# EAGLE design Handclap-TR808 (EAGLE 7.2.0)
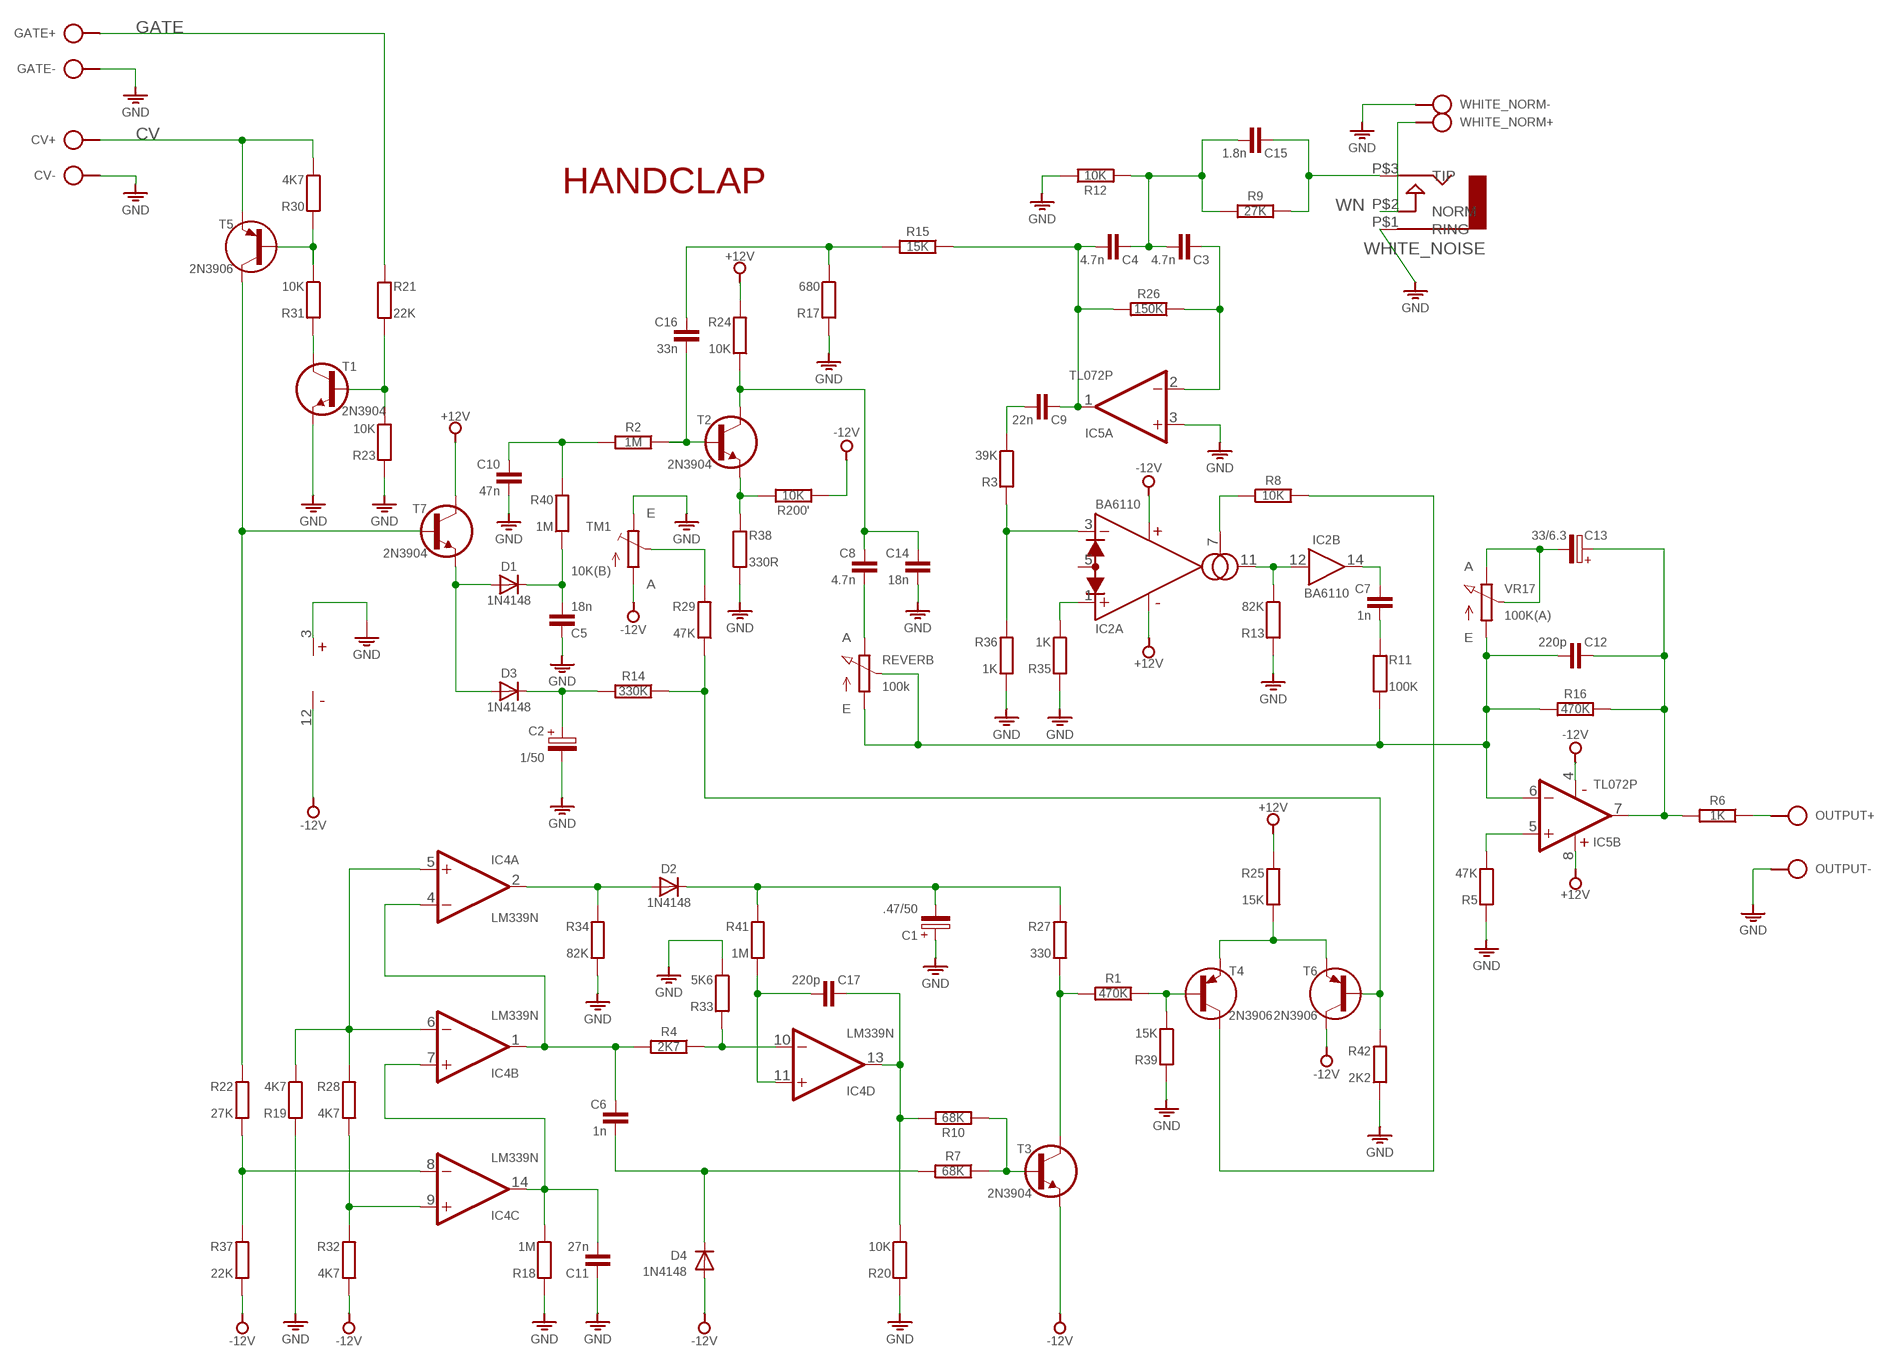
[diagram p0: schematic, sheet 1]

## Parts
C1  .47/50  CPOLE2,5-3/V  [E2,5-3/V]
C2  1/50  CPOLE2,5-4/V  [E2.5-4/V]
C3  4.7n  C-H050-020X044  [C050-020X044]
C4  4.7n  C-H050-020X044  [C050-020X044]
C5  18n  C050-020X044/V  [C050-020X044/V]
C6  1n  C050-020X044/V  [C050-020X044/V]
C7  1n  C050-020X044/V  [C050-020X044/V]
C8  4.7n  C050-020X044/V  [C050-020X044/V]
C9  22n  C-H050-020X044  [C050-020X044]
C10  47n  C050-020X044/V  [C050-020X044/V]
C11  27n  C050-020X044/V  [C050-020X044/V]
C12  220p  C-H050-020X044  [C050-020X044]
C13  33/6.3  CPOL-HE2,5-3  [E2,5-3]
C14  18n  C050-020X044/V  [C050-020X044/V]
C15  1.8n  C-H050-020X044  [C050-020X044]
C16  33n  C050-020X044/V  [C050-020X044/V]
C17  220p  C-H050-020X044  [C050-020X044]
CV  SPAD+--+  [SPAD-+]
D1  1N4148  DIODE-HDO34-10  [DO34-10]
D2  1N4148  DIODE-HDO34-2,5-A/V  [DO34-2,5-A/V]
D3  1N4148  DIODE-HDO34-10  [DO34-10]
D4  1N4148  DIODE34-7V  [DO34-7V]
GATE  SPAD+--+  [SPAD-+]
IC2  BA6110  BA6110-DIL16  [DIL16]
IC4  LM339N  [DIL14]
IC5  TL072P  [DIL08]
OUTPUT  SPAD+--+  [SPAD-+]
PWR1  -12V_GND_+12V-VCC-VEE  [SPAD-PWR-+GND-]
R1  470K  R-H0204/10  [0204/10]
R2  1M  R-H0204/10  [0204/10]
R3  39K  R0204/10-V  [0204/10-V]
R4  2K7  R-H0204/10  [0204/10]
R5  47K  R0204/10-V  [0204/10-V]
R6  1K  R-H0204/10  [0204/10]
R7  68K  R-H0204/10  [0204/10]
R8  10K  R-H0204/10  [0204/10]
R9  27K  R-H0204/10  [0204/10]
R10  68K  R-H0204/10  [0204/10]
R11  100K  R0204/10-V  [0204/10-V]
R12  10K  R-H0204/10  [0204/10]
R13  82K  R0204/10-V  [0204/10-V]
R14  330K  R-H0204/10  [0204/10]
R15  15K  R-H0204/10  [0204/10]
R16  470K  R-H0204/10  [0204/10]
R17  680  R0204/10-V  [0204/10-V]
R18  1M  R0204/10-V  [0204/10-V]
R19  4K7  R0204/10-V  [0204/10-V]
R20  10K  R0204/10-V  [0204/10-V]
R21  22K  R0204/10-V  [0204/10-V]
R22  27K  R0204/10-V  [0204/10-V]
R23  10K  R0204/10-V  [0204/10-V]
R24  10K  R0204/10-V  [0204/10-V]
R25  15K  R0204/10-V  [0204/10-V]
R26  150K  R-H0204/10  [0204/10]
R27  330  R0204/10-V  [0204/10-V]
R28  4K7  R0204/10-V  [0204/10-V]
R29  47K  R0204/10-V  [0204/10-V]
R30  4K7  R0204/10-V  [0204/10-V]
R31  10K  R0204/10-V  [0204/10-V]
R32  4K7  R0204/10-V  [0204/10-V]
R33  5K6  R0204/10-V  [0204/10-V]
R34  82K  R0204/10-V  [0204/10-V]
R35  1K  R0204/10-V  [0204/10-V]
R36  1K  R0204/10-V  [0204/10-V]
R37  22K  R0204/10-V  [0204/10-V]
R38  330R  R0204/10-V  [0204/10-V]
R39  15K  R0204/10-V  [0204/10-V]
R40  1M  R0204/10-V  [0204/10-V]
R41  1M  R0204/10-V  [0204/10-V]
R42  2K2  R0204/10-V  [0204/10-V]
R200'  10K  R-H0204/10  [0204/10]
REVERB  100k  POT-3P  [CONN-3P]
T1  2N3904  [TO92]
T2  2N3904  [TO92]
T3  2N3904  [TO92]
T4  2N3906  [TO92]
T5  2N3906  [TO92]
T6  2N3906  [TO92]
T7  2N3904  [TO92]
TM1  10K(B)  TRIMR-TRIM  [R-TRIM]
VR17  100K(A)  POT-3P  [CONN-3P]
WHITE_NOISE  AUDIO-JACK  [ERTHENVAR-JACK-90DEG]
WHITE_NORM  SPAD+-+-  [SPAD+-]

## Nets
+12V [Power]: IC2.9(1:V-) IC5.8(P:V+) PWR1.VCC R24.1 R25.1 T7.3(C)
-12V: D4.A IC2.15(1:V+) IC4.12(5:V-) IC5.4(P:V-) PWR1.VEE R32.2 R37.2 R200'.2 T3.1(E) T6.3(C) TM1.1(A)
A_OUT: D2.A IC4.2(A:OUT) R34.1
B_OUT: C6.1 IC4.1(B:OUT) IC4.4(A:-IN) R4.2
C_OUT: C11.2 IC4.7(B:+IN) IC4.14(C:OUT) R18.2
CV: CV.2 R30.2 T5.1(E)
D_OUT: C17.1 IC4.13(D:OUT) R10.1 R20.2
GATE: GATE.2 R21.1
GND [GND]: C1.+ C2.- C5.1 C10.2 C11.1 C14.2 CV.1 GATE.1 IC4.3(5:V+) IC5.3(A:+IN) OUTPUT.1 PWR1.GND R5.1 R12.1 R13.1 R17.1 R18.1 R19.1 R20.1 R23.1 R33.2 R34.2 R35.1 R36.2 R38.2 R39.1 R42.2 T1.1(E) TM1.3(E) WHITE_NOISE.P$1(RING) WHITE_NORM.1
N$1: OUTPUT.2 R6.1
N$2: WHITE_NOISE.P$2(NORM) WHITE_NORM.2
N$3: R31.1 T1.3(C)
N$4: R21.2 R23.2 T1.2(B)
N$10: C4.2 C9.1 IC5.1(A:OUT) R15.1 R26.2
N$37: R30.1 R31.2 T5.2(B)
N$40: C16.2 R2.1 T2.2(B)
N$41: C5.2 D1.C R40.2
N$42: R38.1 R200'.1 T2.1(E)
N$43: R22.1 T5.3(C) T7.2(B)
N$44: D1.A D3.A T7.1(E)
N$45: C10.1 R2.2 R40.1
N$46: C8.1 C14.1 R24.2 T2.3(C)
N$47: C2.+ D3.C R14.2
N$48: R14.1 R29.2 R42.1 T6.2(B)
N$49: R29.1 TM1.2(S)
N$50: C16.1 R15.2 R17.2
N$52: C3.2 C4.1 C15.2 R9.2 R12.2
N$54: C3.1 IC5.2(A:-IN) R26.1
N$55: C9.2 R3.2
N$56: IC2.3(A:-IN) R3.1 R36.1
N$57: C8.2 REVERB.3(E)
N$59: IC2.1(A:+IN) R35.2
N$60: IC2.7(A:AMP/BIAS) R8.1
N$61: IC2.11(A:OUT) IC2.12(B:B_IN) R13.2
N$62: C7.2 R11.1
N$63 [special]: C7.1 IC2.14(B:B_OUT)
N$64: IC4.5(A:+IN) IC4.6(B:-IN) R19.2 R28.1
N$65: C1.- D2.C R27.1 R41.1
N$66: R1.1 R39.2 T4.2(B)
N$67: R25.2 T4.1(E) T6.1(E)
N$69: R8.2 T4.3(C)
N$70: R1.2 R27.2 T3.3(C)
N$71: IC4.9(C:+IN) R28.2 R32.1
N$72: C17.2 IC4.11(D:+IN) R41.2
N$73: IC4.10(D:-IN) R4.1 R33.1
N$74: IC4.8(C:-IN) R22.2 R37.1
N$75: R7.1 R10.2 T3.2(B)
N$76: C6.2 D4.C R7.2
N$91: IC5.5(B:+IN) R5.2
N$92 [special]: C12.2 IC5.6(B:-IN) R11.2 R16.2 REVERB.1(A) REVERB.2(S) VR17.1(A)
N$95: C13.- VR17.2(S) VR17.3(E)
N$97: C12.1 C13.+ IC5.7(B:OUT) R6.2 R16.1
WN: C15.1 R9.1 WHITE_NOISE.P$3(TIP)
Unconnected: IC2.5(A:DIODE/BIAS)

## Notes on the sheet
- HANDCLAP

## Library data of the parts
C1 C2 = c:CPOL: POLARIZED CAPACITOR, European symbol
C3 C4 C9 C12 C15 C17 = c:C-H
C5-C8 C10 C11 C14 C16 = c:C: CAPACITOR, European symbol
C13 = c:CPOL-H
CV GATE OUTPUT WHITE_NORM = pad:SPAD+-
D1-D3 = d:DIODE-H
D4 = d:DIODE
IC2 = ic:BA6110
IC4 = ic:LM339
IC5 = ic:TL072: Low-Noise JFET-Input Operational Amplifiers http://www.ti.com/lit/ds/symlink/tl072.pdf
PWR1 = pad:-12V_GND_+12V
R1 R2 R4 R6-R10 R12 R14-R16 R26 R200' = r:R-H
R3 R5 R11 R13 R17-R25 R27-R42 = r:R: RESISTOR, European symbol
REVERB VR17 = r:POT
T1-T3 T7 = t:2N3904
T4-T6 = t:2N3906
TM1 = r:TRIM: POTENTIOMETER
WHITE_NOISE = erthenvar:AUDIO-JACK: Switching Mono 3.5mm Audio Jack from Erthenvar.

## Net classes
0 default: width 0.61 mm
1 GND: width 0.61 mm
2 Power: width 0.61 mm
3 special: width 0.61 mm
4 15v: width 0.61 mm

## Board
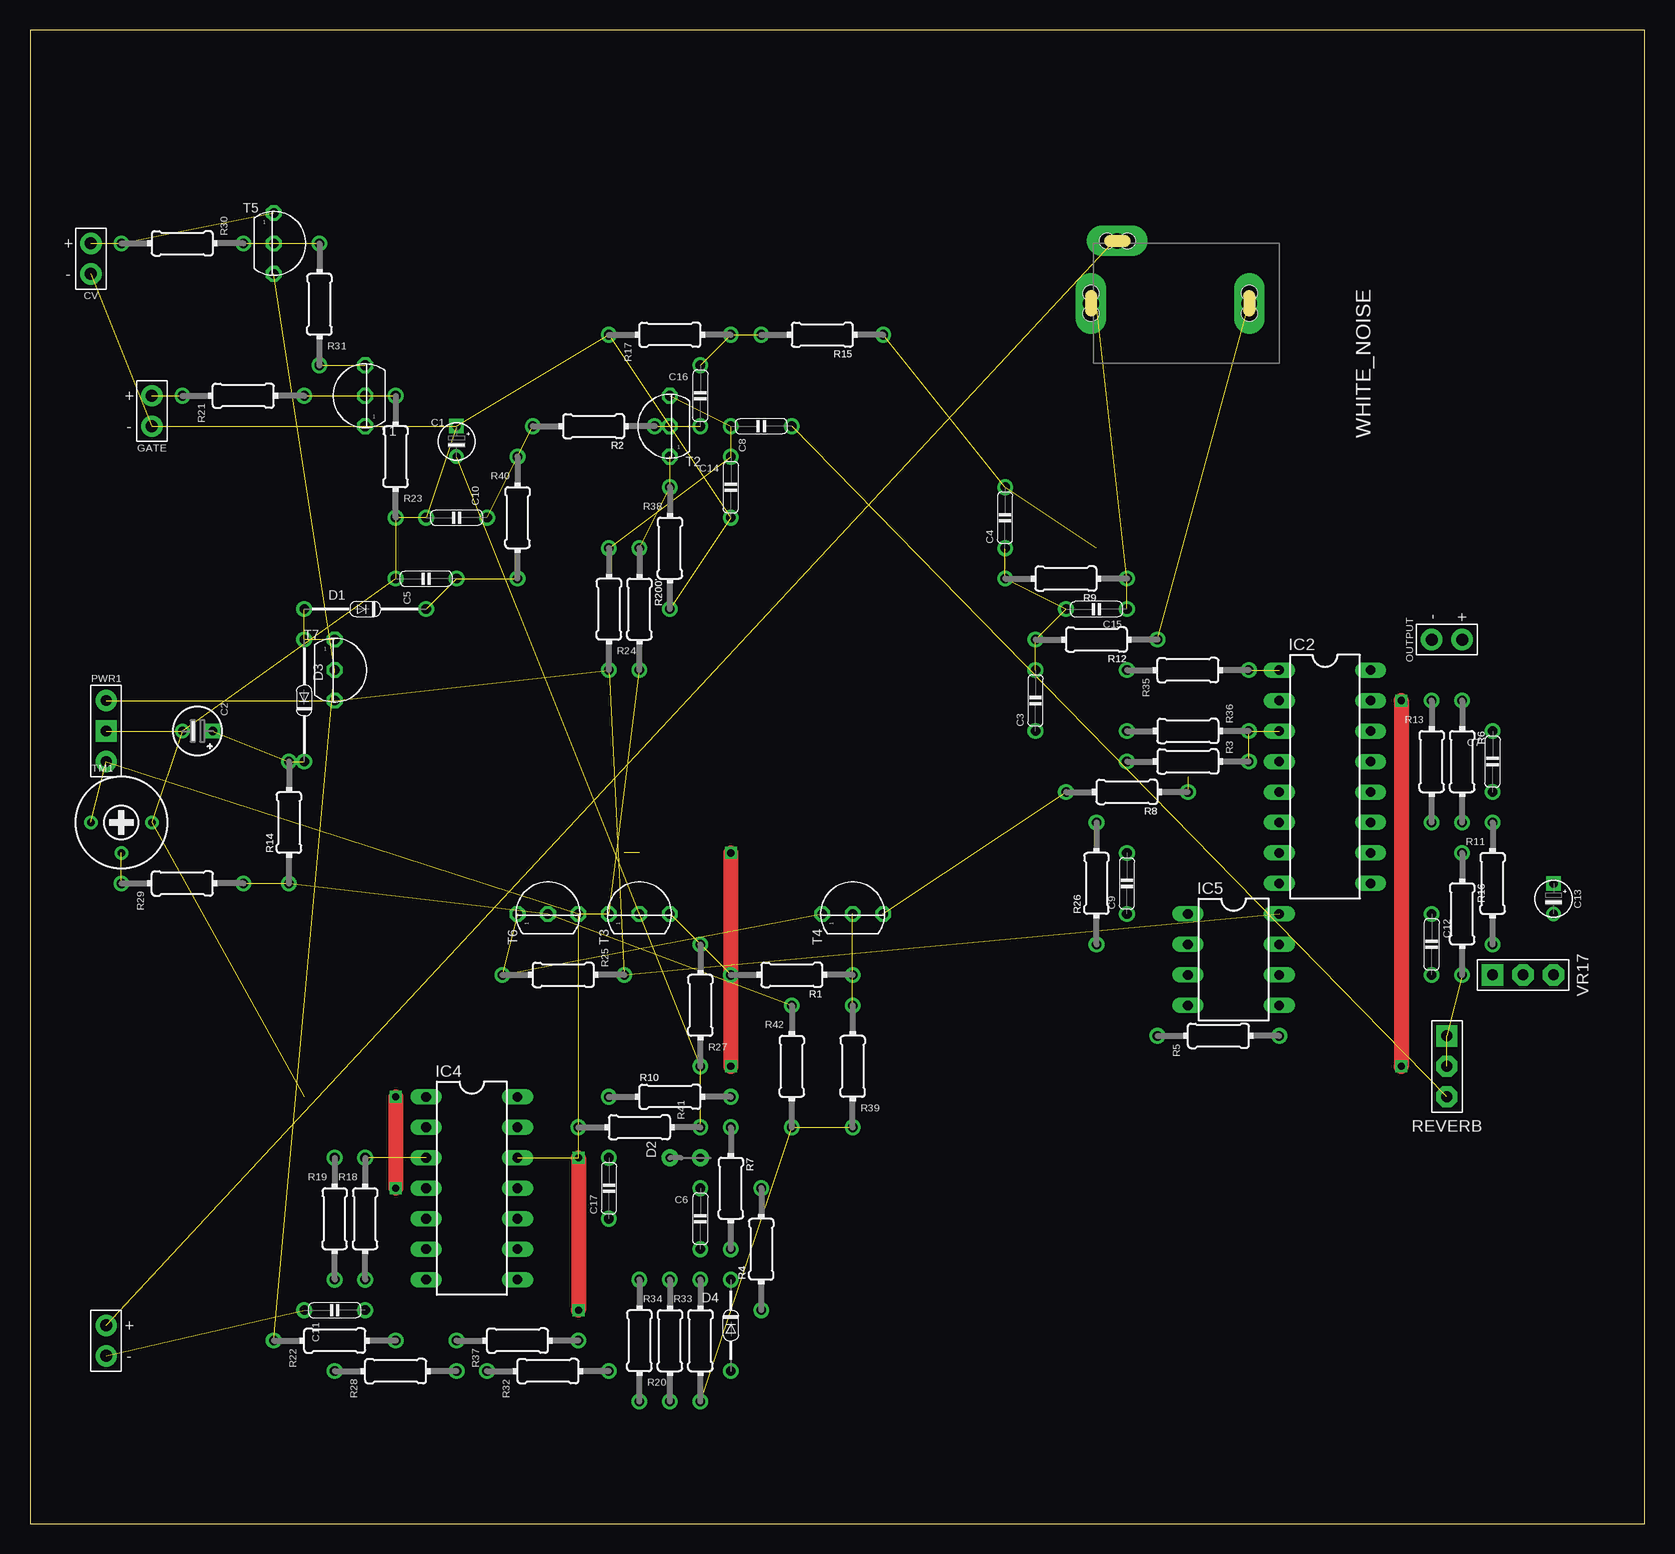
[diagram p1: board, top side]
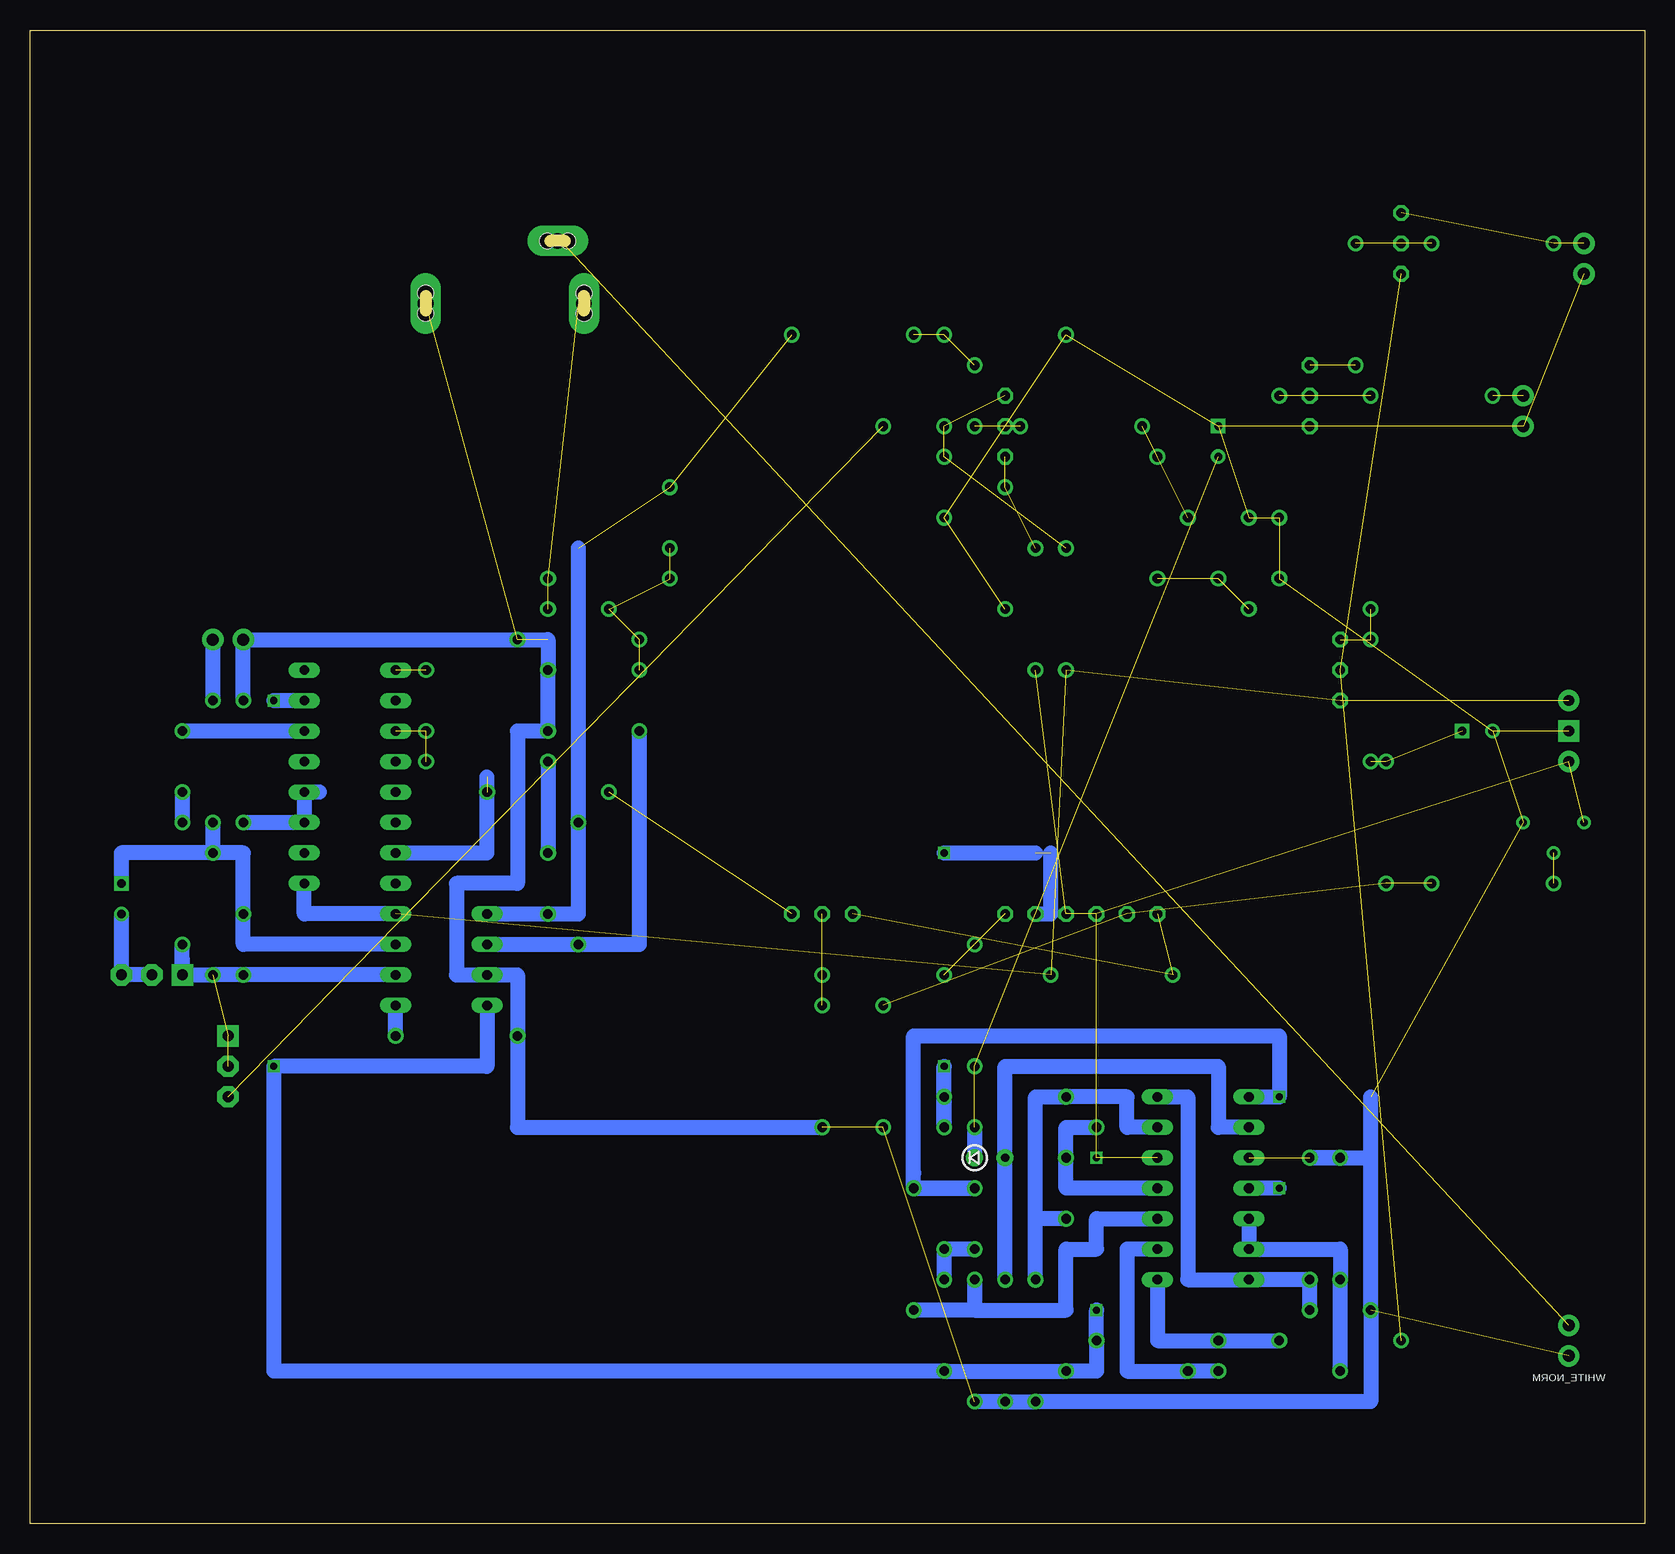
[diagram p2: board, bottom side, seen from below]

Size 134.62 x 124.46 mm. Coordinates in mm from the lower left corner, seen from the top.
Outline: 0,0 134.62,0 134.62,124.46 0,124.46 0,0
Copper layers (1*16): Top 0.035mm / dielectric 1.5mm / Bottom 0.035mm
Design rules "default": minimum track width 10mil, minimum drill 24mil, track to track 8mil, track to pad 8mil, pad to pad 8mil, via to via 8mil, smd to smd 8mil, copper to edge 40mil, drill to drill 8mil, minimum pad ring 10mil, minimum via ring 8mil, stop-mask expansion 4mil, vias tented up to drill 0mil, thermal gap 10mil

### Footprints (pad centres in the part's own frame; a part is rotated, then mirrored left to right if it is on the bottom)
E2,5-3/V = drill 0.7 square: + 0,1.27 | drill 0.7: - 0,-1.27
E2.5-4/V = drill 0.7 square: + 0,1.27 | drill 0.7: - 0,-1.27
C050-020X044 = drill 0.8: 1 -2.54,0; 2 2.54,0
C050-020X044/V = drill 0.8: 1 0,2.54; 2 0,-2.54
E2,5-3 = drill 0.7 square: + -1.27,0 | drill 0.7: - 1.27,0
SPAD-+ = drill 1 pad 1.778: 1 0,-1.27; 2 0,1.27
DO34-10 = drill 0.8: A 5.08,0; C -5.08,0
DO34-2,5-A/V = drill 0.7 pad 1.422: A 0,1.27; C 0,-1.27
DO34-7V = drill 0.8: A 0,-3.81; C 0,3.81
DIL16 = drill 0.8 long: 1 -3.81,8.89; 2 -3.81,6.35; 3 -3.81,3.81; 4 -3.81,1.27; 5 -3.81,-1.27; 6 -3.81,-3.81; 7 -3.81,-6.35; 8 -3.81,-8.89; 9 3.81,-8.89; 10 3.81,-6.35; 11 3.81,-3.81; 12 3.81,-1.27; 13 3.81,1.27; 14 3.81,3.81; 15 3.81,6.35; 16 3.81,8.89
DIL14 = drill 0.8 long: 1 -3.81,7.62; 2 -3.81,5.08; 3 -3.81,2.54; 4 -3.81,0; 5 -3.81,-2.54; 6 -3.81,-5.08; 7 -3.81,-7.62; 8 3.81,-7.62; 9 3.81,-5.08; 10 3.81,-2.54; 11 3.81,0; 12 3.81,2.54; 13 3.81,5.08; 14 3.81,7.62
DIL08 = drill 0.8 pad 1.27 long: 1 -3.81,3.81; 2 -3.81,1.27; 3 -3.81,-1.27; 4 -3.81,-3.81; 5 3.81,-3.81; 6 3.81,-1.27; 7 3.81,1.27; 8 3.81,3.81
SPAD-PWR-+GND- = drill 0.9 pad 1.778 square: GND 0,0 | drill 0.9 pad 1.778: VCC 0,2.54; VEE 0,-2.54
0204/10 = drill 0.8: 1 -5.08,0; 2 5.08,0
0204/10-V = drill 0.8: 1 0,5.08; 2 0,-5.08
CONN-3P = drill 0.9 pad 1.778 square: 1 0,-2.54 | drill 0.9 pad 1.778 octagon: 2 0,0; 3 0,2.54
TO92 = drill 0.8 octagon: 1 0,2.54; 2 0,0; 3 0,-2.54
R-TRIM = drill 0.61: 1 -2.54,0; 2 0,-2.54; 3 2.54,0
ERTHENVAR-JACK-90DEG = drill 1.3 pad 2.54 long: P$1 5,-2.5; P$2 -0.2,-13.5; P$3 5,-15.7 | hole 1.3: 5.842,-2.489; 4.14,-2.489; -0.203,-12.649; -0.203,-14.351; 5.842,-15.697; 4.166,-15.697
SPAD+- = drill 1 pad 1.778: 1 0,-1.27; 2 0,1.27

### Placement (x,y rotation side)
C1  35.56,90.17 0 top
C2  13.97,66.04 270 top
C3  83.82,68.58 90 top
C4  81.28,83.82 90 top
C5  33.02,78.74 90 top
C6  55.88,25.4 0 top
C7  121.92,63.5 0 top
C8  60.96,91.44 90 top
C9  91.44,53.34 90 top
C10  35.56,83.82 270 top
C11  25.4,17.78 90 top
C12  116.84,48.26 270 top
C13  127,52.07 270 top
C14  58.42,86.36 0 top
C15  88.9,76.2 180 top
C16  55.88,93.98 0 top
C17  48.26,27.94 90 top
CV  5.08,105.41 0 top
D1  27.94,76.2 180 top
D2  54.61,30.48 90 top
D3  22.86,68.58 90 top
D4  58.42,16.51 0 top
GATE  10.16,92.71 0 top
IC2  107.95,62.23 0 top
IC4  36.83,27.94 0 top
IC5  100.33,46.99 0 top
OUTPUT  118.11,73.66 270 top
PWR1  6.35,66.04 0 top
R1  63.5,45.72 180 top
R2  46.99,91.44 180 top
R3  96.52,63.5 270 top
R4  60.96,22.86 90 top
R5  99.06,40.64 90 top
R6  119.38,63.5 270 top
R7  58.42,27.94 270 top
R8  91.44,60.96 180 top
R9  86.36,78.74 180 top
R10  53.34,35.56 0 top
R11  121.92,53.34 0 top
R12  88.9,73.66 180 top
R13  116.84,63.5 0 top
R14  21.59,58.42 90 top
R15  66.04,99.06 180 top
R16  119.38,50.8 270 top
R17  53.34,99.06 90 top
R18  27.94,25.4 0 top
R19  25.4,25.4 0 top
R20  50.8,15.24 180 top
R21  17.78,93.98 90 top
R22  25.4,15.24 90 top
R23  30.48,88.9 180 top
R24  48.26,76.2 180 top
R25  44.45,45.72 270 top
R26  88.9,53.34 90 top
R27  55.88,43.18 180 top
R28  30.48,12.7 90 top
R29  12.7,53.34 90 top
R30  12.7,106.68 270 top
R31  24.13,101.6 180 top
R32  43.18,12.7 90 top
R33  55.88,15.24 0 top
R34  53.34,15.24 0 top
R35  96.52,71.12 90 top
R36  96.52,66.04 270 top
R37  40.64,15.24 90 top
R38  53.34,81.28 0 top
R39  68.58,38.1 180 top
R40  40.64,83.82 0 top
R41  50.8,33.02 270 top
R42  63.5,38.1 0 top
R200'  50.8,76.2 270 top
REVERB  118.11,38.1 180 top
T1  27.94,93.98 180 top
T2  53.34,91.44 180 top
T3  50.8,50.8 90 top
T4  68.58,50.8 90 top
T5  20.32,106.68 0 top
T6  43.18,50.8 90 top
T7  25.4,71.12 0 top
TM1  7.62,58.42 0 top
VR17  124.46,45.72 270 top
WHITE_NOISE  104.14,106.68 270 top
WHITE_NORM  6.35,15.24 0 top

### Tracks (layer width: path | path; a pad name or v marks a point on that pad's centre or on a via)
+12V  (4 unrouted)
  Bottom 1.27: IC5.8 111.76,50.8 IC2.9
-12V  (via drill 0.6)  (6 unrouted)
  Top 1.27: v45.72,30.48 v45.72,17.78 | v114.3,68.58 v114.3,38.1
  Bottom 1.27: v45.72,17.78 R37.2 45.72,12.7 R32.2 D4.A 114.3,12.7 v114.3,38.1 96.52,38.1 IC5.4 | IC2.15 v114.3,68.58
A_OUT
  Bottom 1.27: IC4.2 35.56,33.02 35.56,38.1 53.34,38.1 D2.A R34.1
B_OUT  (via drill 0.6)
  Top 1.27: v30.48,35.56 v30.48,27.94
  Bottom 1.27: IC4.1 v30.48,35.56 30.48,40.64 60.96,40.64 60.96,29.21 R4.2 | v30.48,27.94 IC4.4 | R4.2 C6.1 R4.2
C_OUT
  Bottom 1.27: IC4.14 38.1,35.56 38.1,20.32 IC4.7 R18.2 C11.2
CV  (2 unrouted)
D_OUT
  Bottom 1.27: IC4.13 43.18,33.02 43.18,35.56 R10.1 50.8,35.56 50.8,25.4 | R20.2 50.8,25.4 | C17.1 50.8,25.4
GATE  (1 unrouted)
GND  (19 unrouted)
  Bottom 1.27: 22.86,30.48 R18.1 R19.1 | 22.86,30.48 22.86,35.56 | R33.2 R34.2 R20.1 22.86,10.16 C11.1 22.86,30.48 | R13.1 OUTPUT.1 91.44,73.66 R35.1 R36.2 93.98,66.04 93.98,53.34 99.06,53.34 99.06,45.72 IC5.3 93.98,45.72 R5.1 93.98,33.02 R39.1
N$1
  Bottom 1.27: OUTPUT.2 R6.1
N$2  (1 unrouted)
N$3  (1 unrouted)
N$4  (2 unrouted)
N$10  (2 unrouted)
  Bottom 1.27: 88.9,81.28 R26.2 88.9,50.8 C9.1 IC5.1
N$37  (2 unrouted)
N$40  (2 unrouted)
N$41  (2 unrouted)
N$42  (2 unrouted)
N$43  (2 unrouted)
N$44  (2 unrouted)
N$45  (2 unrouted)
N$46  (3 unrouted)
N$47  (2 unrouted)
N$48  (3 unrouted)
N$49  (1 unrouted)
N$50  (2 unrouted)
N$52  (4 unrouted)
N$54
  Bottom 1.27: IC5.2 R26.1 83.82,48.26 C3.1
N$55
  Bottom 1.27: R3.2 C9.2
N$56  (2 unrouted)
N$57  (1 unrouted)
N$59  (1 unrouted)
N$60  (1 unrouted)
  Bottom 1.27: IC2.7 96.52,55.88 96.52,62.23
N$61
  Bottom 1.27: R13.2 IC2.11 IC2.12 110.49,60.96
N$62
  Bottom 1.27: C7.2 R11.1
N$63
  Bottom 1.27: IC2.14 C7.1
N$64
  Bottom 1.27: R28.1 R19.2 25.4,22.86 IC4.6 IC4.5
N$65  (2 unrouted)
  Bottom 1.27: R41.1 D2.C
N$66  (2 unrouted)
N$67  (2 unrouted)
N$69  (1 unrouted)
N$70  (2 unrouted)
N$71
  Bottom 1.27: IC4.9 43.18,22.86 43.18,12.7 R32.1 R28.2
N$72
  Bottom 1.27: IC4.11 48.26,27.94 C17.2 48.26,33.02 R41.2
N$73
  Bottom 1.27: 55.88,17.78 48.26,17.78 48.26,22.86 45.72,22.86 45.72,25.4 IC4.10 | R33.1 55.88,17.78 | 55.88,17.78 57.15,17.78 R4.1
N$74
  Bottom 1.27: IC4.8 40.64,15.24 R37.1 R22.2
N$75  (via drill 0.6)  (1 unrouted)
  Top 1.27: v58.42,38.1 v58.42,55.88
  Bottom 1.27: R10.2 R7.1 v58.42,38.1 | v58.42,55.88 50.8,55.88 | T3.2 49.53,50.8 49.53,55.88
N$76
  Bottom 1.27: C6.2 R7.2 D4.C
N$91
  Bottom 1.27: R5.2 IC5.5
N$92  (2 unrouted)
  Bottom 1.27: IC5.6 C12.2 R16.2 VR17.1 | 121.92,46.99 VR17.1 | VR17.1 R11.2
N$95
  Bottom 1.27: C13.- VR17.3 VR17.2
N$97
  Bottom 1.27: IC5.7 116.84,48.26 C12.1 116.84,55.88 R16.1 | R6.2 R16.1 | R16.1 127,55.88 C13.+
WN  (2 unrouted)